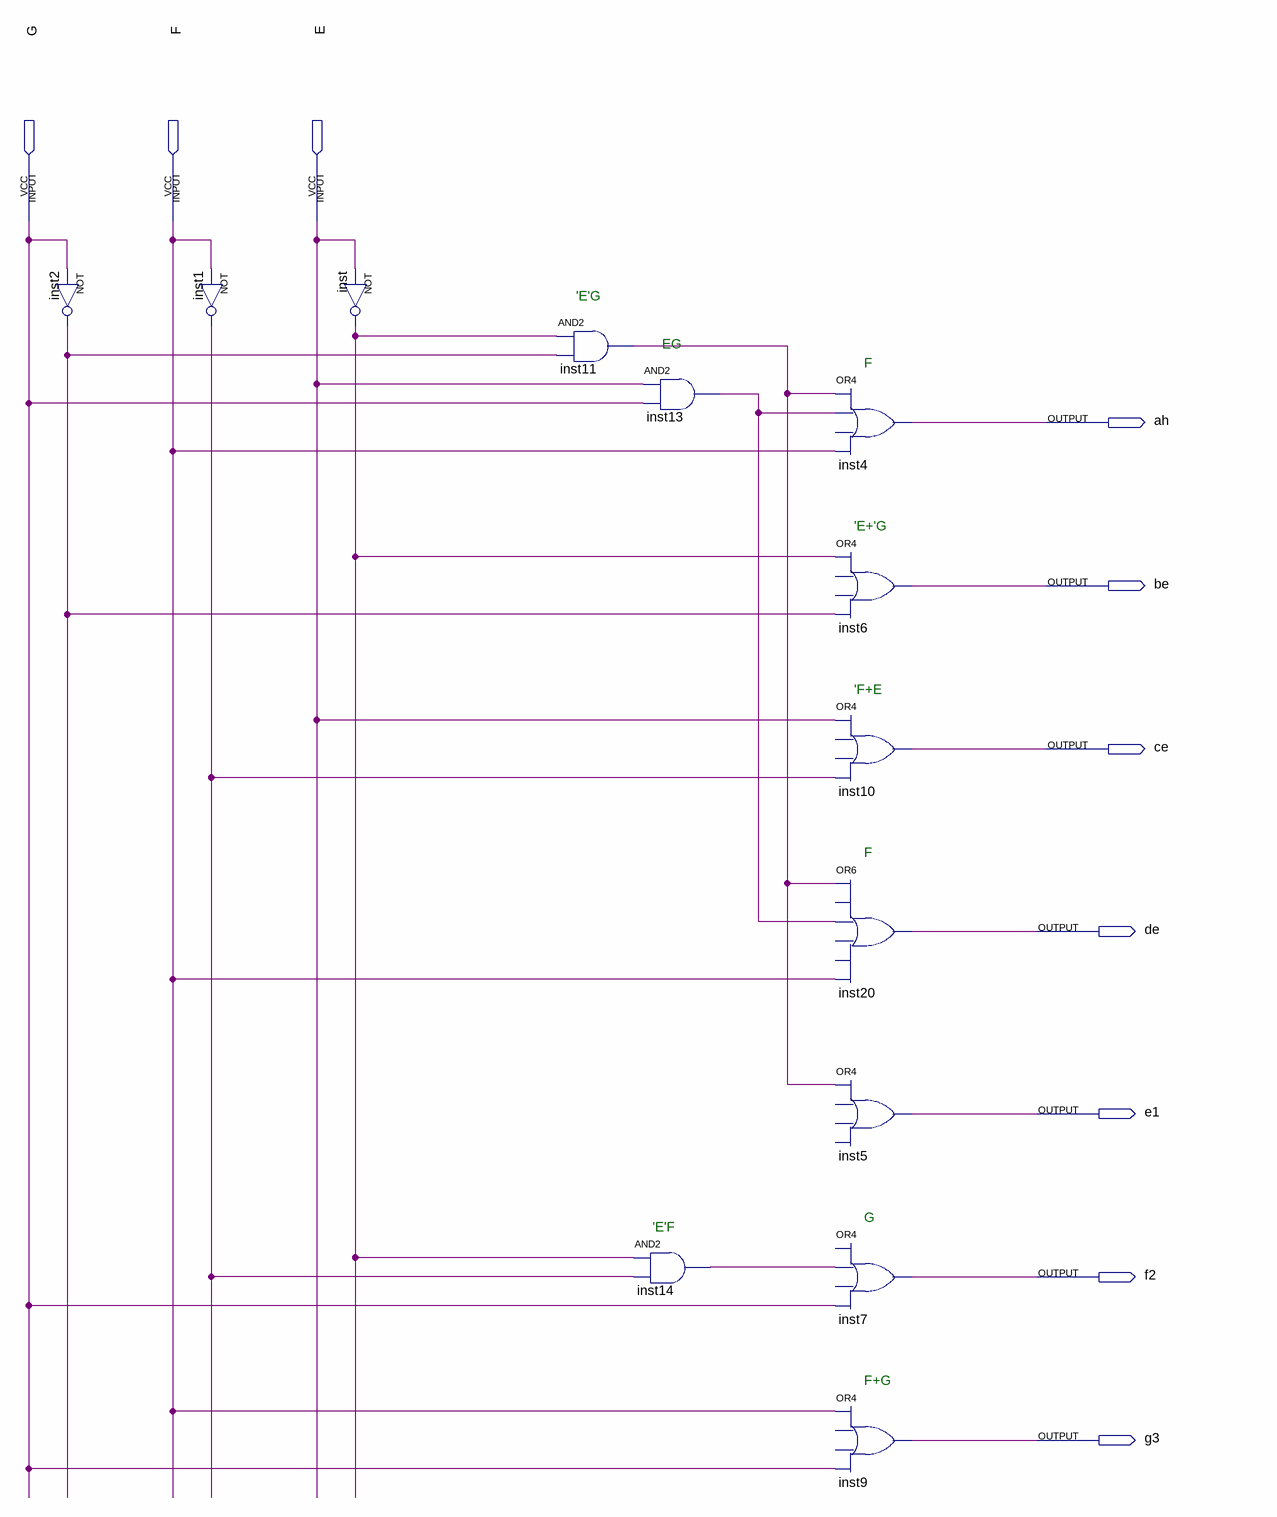
[diagram p0: schematic sheet]
// Quartus schematic decoder0a5.bdf as structural Verilog: 13 symbols, 10 pins
module decoder0a5 (
  input  G,
  input  F,
  input  E,
  output ah,
  output be,
  output ce,
  output de,
  output e1,
  output f2,
  output g3
);

  wire inst1_out, inst2_out, inst11_out, inst13_out, inst14_out, inst_out;

  not inst2 (inst2_out, G);
  not inst1 (inst1_out, F);
  not inst (inst_out, E);
  and inst11 (inst11_out, inst_out, inst2_out);
  and inst13 (inst13_out, E, G);
  and inst14 (inst14_out, inst_out, inst1_out);
  or inst4 (ah, inst11_out, inst13_out, F);  // open: IN3
  or inst6 (be, inst_out, inst2_out);  // open: IN2, IN3
  or inst10 (ce, E, inst1_out);  // open: IN2, IN3
  or inst20 (de, inst11_out, inst13_out, F);  // open: IN2, IN4, IN5
  buf inst5 (e1, inst11_out);  // OR4 open: IN2, IN3, IN4
  or inst7 (f2, inst14_out, G);  // open: IN1, IN3
  or inst9 (g3, F, G);  // open: IN2, IN3

  // Notes on the sheet:
  //   'E'G
  //   EG
  //   F
  //   'E+'G
  //   'F+E
  //   F
  //   G
  //   'E'F
  //   F+G
endmodule
